# Altium schematic sheet psu.SchDoc
size A
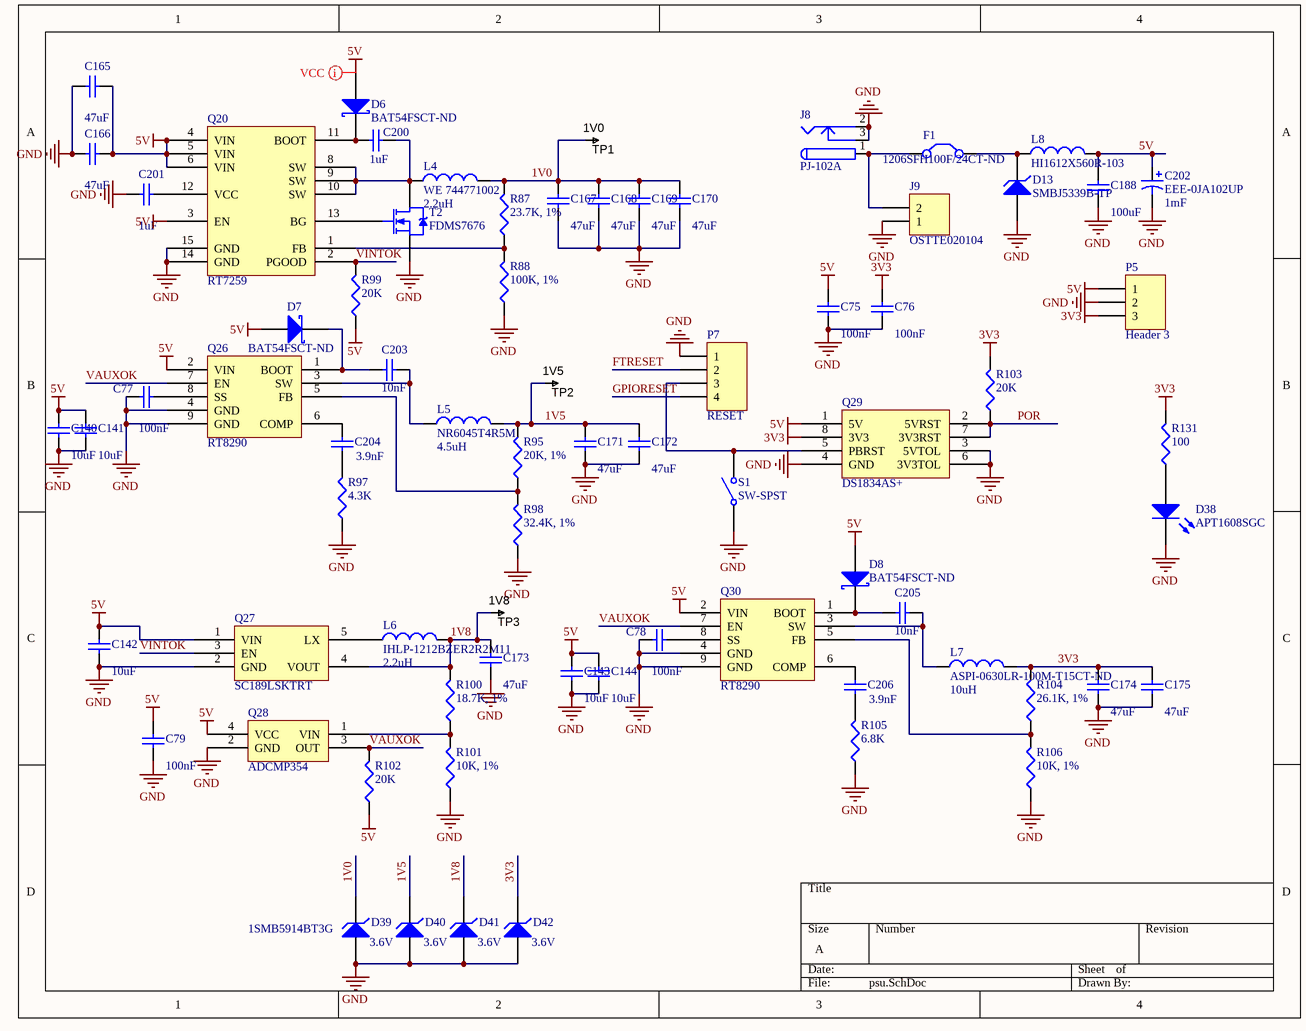
[diagram p0: psu.SchDoc]

## Parts
C75  value 100nF  [CAPC1005X06L]  (hidden comment: Cap)
C76  value 100nF  [CAPC1005X06L]  (hidden comment: Cap)
C77  value 100nF  [CAPC1005X06L]  (hidden comment: Cap)
C78  value 100nF  [CAPC1005X06L]  (hidden comment: Cap)
C79  value 100nF  [CAPC1005X06L]  (hidden comment: Cap)
C140  value 10uF  [CAPC1608X90N]  (hidden comment: GRM188R60G106ME47)
C141  value 10uF  [CAPC1608X90N]  (hidden comment: GRM188R60G106ME47)
C142  value 10uF  [CAPC1608X90N]  (hidden comment: GRM188R60G106ME47)
C143  value 10uF  [CAPC1608X90N]  (hidden comment: GRM188R60G106ME47)
C144  value 10uF  [CAPC1608X90N]  (hidden comment: GRM188R60G106ME47)
C165  value 47uF  [CAPC3225X220N]  (hidden comment: GRM31CR60J476ME19L)
C166  value 47uF  [CAPC3225X220N]  (hidden comment: GRM31CR60J476ME19L)
C167  value 47uF  [CAPC3225X220N]  (hidden comment: GRM31CR60J476ME19L)
C168  value 47uF  [CAPC3225X220N]  (hidden comment: GRM31CR60J476ME19L)
C169  value 47uF  [CAPC3225X220N]  (hidden comment: GRM31CR60J476ME19L)
C170  value 47uF  [CAPC3225X220N]  (hidden comment: GRM31CR60J476ME19L)
C171  value 47uF  [CAPC3225X220N]  (hidden comment: GRM31CR60J476ME19L)
C172  value 47uF  [CAPC3225X220N]  (hidden comment: GRM31CR60J476ME19L)
C173  value 47uF  [CAPC3225X220N]  (hidden comment: GRM31CR60J476ME19L)
C174  value 47uF  [CAPC3225X220N]  (hidden comment: GRM31CR60J476ME19L)
C175  value 47uF  [CAPC3225X220N]  (hidden comment: GRM31CR60J476ME19L)
C188  value 100uF  [CAPC3225X220N]  (hidden comment: GRM31CR60J107ME39L)
C200  value 1uF  [CAPC1608X90N]  (hidden comment: GRM188R60J105KA01D)
C201  value 1uF  [CAPC1608X90N]  (hidden comment: GRM188R60J105KA01D)
C202  EEE-0JA102UP  value 1mF  [CAP_ELEC_SIZE_E]
C203  value 10nF  [CAPC1005X06L]  (hidden comment: GRM188R71H103KA01D)
C204  value 3.9nF  [CAPC1608X90N]  (hidden comment: CL10B393KO8NNNC)
C205  value 10nF  [CAPC1005X06L]  (hidden comment: GRM188R71H103KA01D)
C206  value 3.9nF  [CAPC1608X90N]  (hidden comment: CL10B393KO8NNNC)
D6  BAT54FSCT-ND  [BAT54]
D7  BAT54FSCT-ND  [BAT54]
D8  BAT54FSCT-ND  [BAT54]
D13  SMBJ5339B-TP  [DO-214AA]
D38  APT1608SGC  [LED-0603]
D39  1SMB5914BT3G  value 3.6V  [DO-214AA]
D40  value 3.6V  [DO-214AA]  (hidden comment: 1SMB5914BT3G)
D41  value 3.6V  [DO-214AA]  (hidden comment: 1SMB5914BT3G)
D42  value 3.6V  [DO-214AA]  (hidden comment: 1SMB5914BT3G)
F1  1206SFH100F/24CT-ND  [CAPC3225X220N]
J8  PJ-102A  [PJ-102A]
J9  OSTTE020104  [OSTTEE02014]
L4  WE 744771002  value 2.2uH  [WE 744771002]
L5  NR6045T4R5M  value 4.5uH  [NR6045]
L6  IHLP-1212BZER2R2M11  value 2.2uH  [IHLP-1212BZ]
L7  ASPI-0630LR-100M-T15CT-ND  value 10uH  [ASPI-0630LR]
L8  HI1612X560R-103  [IND1612]
P5  Header 3  [HDR1X3]
P7  RESET  [HDR1X4]
Q20  RT7259  [WFDN-14L 4x3]
Q26  RT8290  [SOIC127P600X135_HS-9N]
Q27  SC189LSKTRT  [SOT23-5]
Q28  ADCMP354  [SC70-4]
Q29  DS1834AS+  [SOIC127P600X175-8AN]
Q30  RT8290  [SOIC127P600X135_HS-9N]
R87  value 23.7K, 1%  [J1-0603]  (hidden comment: RC1608F2372CS)
R88  value 100K, 1%  [J1-0603]  (hidden comment: RC1608F104CS)
R95  value 20K, 1%  [J1-0603]  (hidden comment: RC1608F203CS)
R97  value 4.3K  [J1-0603]  (hidden comment: RC1608F432CS)
R98  value 32.4K, 1%  [J1-0603]  (hidden comment: RC1608F3242CS)
R99  value 20K  [J1-0603]  (hidden comment: RC1608F203CS)
R100  value 18.7K, 1%  [J1-0603]  (hidden comment: RC1608F1872CS)
R101  value 10K, 1%  [J1-0603]  (hidden comment: RC1608F103CS)
R102  value 20K  [J1-0603]  (hidden comment: RC1608F203CS)
R103  value 20K  [J1-0603]  (hidden comment: RC1608F203CS)
R104  value 26.1K, 1%  [J1-0603]  (hidden comment: RC1608F2612CS)
R105  value 6.8K  [J1-0603]  (hidden comment: RC1608F682CS)
R106  value 10K, 1%  [J1-0603]  (hidden comment: RC1608F103CS)
R131  value 100  [J1-0603]  (hidden comment: RC1608F101CS)
S1  SW-SPST  [FSM4JSMA]
T2  FDMS7676  [PowerSO8]
TP1  1V0  [TP-R60]  (no BOM)
TP2  1V5  [TP-R60]  (no BOM)
TP3  1V8  [TP-R60]  (no BOM)

## Nets
3V3: C76.2 C174.2 C175.2 D42.K L7.2 P5.3 Q29.8(3V3) R103.2 R104.2 R131.2
5V: C75.2 C79.2 C140.2 C141.2 C142.2 C143.2 C144.2 C165.2 C166.2 C188.2 C202.1 D6.1(A) D7.1(A) D8.1(A) L8.2 P5.1 Q20.3(EN) Q20.4(VIN) Q20.5(VIN) Q20.6(VIN) Q26.2(VIN) Q27.1(VIN) Q28.4(VCC) Q29.1(5V) Q30.2(VIN) R99.1 R102.1
GND: C75.1 C76.1 C77.1 C78.1 C79.1 C140.1 C141.1 C142.1 C143.1 C144.1 C165.1 C166.1 C167.1 C168.1 C169.1 C170.1 C171.1 C172.1 C173.1 C174.1 C175.1 C188.1 C201.2 C202.2 D13.A D38.K D39.A D40.A D41.A D42.A J8.2 J8.3 J9.1 P5.2 P7.1 Q20.14(GND) Q20.15(GND) Q26.4(GND) Q26.9(GND) Q27.2(GND) Q28.2(GND) Q29.3(5VTOL) Q29.4(GND) Q29.6(3V3TOL) Q30.4(GND) Q30.9(GND) R88.1 R97.1 R98.1 R101.1 R105.1 R106.1 S1.4(COMMON) T2.3(S)
1V0: C167.2 C168.2 C169.2 C170.2 D39.K L4.2 R87.2 TP1.1
1V5: C171.2 C172.2 D40.K L5.2 R95.2 TP2.1
1V8: C173.2 D41.K L6.2 Q27.4(VOUT) R100.2 TP3.1
FTRESET: P7.2
GPIORESET: P7.4
POR: Q29.2(5VRST) Q29.7(3V3RST) R103.1
VAUXOK: Q26.7(EN) Q28.3(OUT) Q30.7(EN) R102.2
VINTOK: Q20.2(PGOOD) Q27.3(EN) R99.2
NetC77_2: C77.2 Q26.8(SS)
NetC78_2: C78.2 Q30.8(SS)
NetC200_1: C200.1 L4.1 Q20.8(SW) Q20.9(SW) Q20.10(SW) T2.2(D)
NetC200_2: C200.2 D6.2(K) Q20.11(BOOT)
NetC201_1: C201.1 Q20.12(VCC)
NetC203_1: C203.1 L5.1 Q26.3(SW)
NetC203_2: C203.2 D7.2(K) Q26.1(BOOT)
NetC204_1: C204.1 R97.2
NetC204_2: C204.2 Q26.6(COMP)
NetC205_1: C205.1 L7.1 Q30.3(SW)
NetC205_2: C205.2 D8.2(K) Q30.1(BOOT)
NetC206_1: C206.1 R105.2
NetC206_2: C206.2 Q30.6(COMP)
NetD13_K: D13.K F1.2(C2) L8.1
NetD38_A: D38.A R131.1
NetF1_1: F1.1(C1) J8.1 J9.2
NetL6_1: L6.1 Q27.5(LX)
NetP7_3: P7.3 Q29.5(PBRST) S1.2(NO)
NetQ20_1: Q20.1(FB) R87.1 R88.2
NetQ20_13: Q20.13(BG) T2.1(G)
NetQ26_5: Q26.5(FB) R95.1 R98.2
NetQ28_1: Q28.1(VIN) R100.1 R101.2
NetQ30_5: Q30.5(FB) R104.1 R106.2

## Layout directives
net class VCC: 5V

## Library data of the parts
C75-C79 C140-C144 C165-C175 C188 C200 C201 C203-C206 = Cap: Capacitor; Published: 8-Jun-2000; LatestRevisionDate: 17-Jul-2002; LatestRevisionNote: Re-released for DXP Platform.; PackageReference: RAD-0.3; Publisher: Altium Limited; PackageDescription: Radial Cap, Thru-Hole; 2 Leads; 0.3 in Pin Spacing; Supplier 1: Digi-Key
  C75-C79: Supplier Part Number 1: 1276-1443-1-ND
  C140-C144: Supplier Part Number 1: 490-3298-1-ND
  C165-C175: Supplier Part Number 1: 490-3907-1-ND
  C188: Supplier Part Number 1: 490-4539-1-ND
  C200 C201: Supplier Part Number 1: 490-1550-1-ND
  C203 C205: Supplier Part Number 1: 490-4516-1-ND
  C204 C206: Supplier Part Number 1: 1276-2057-1-ND
C202 = Cap Pol1: Polarized Capacitor (Radial); Published: 8-Jun-2000; LatestRevisionDate: 17-Jul-2002; LatestRevisionNote: Re-released for DXP Platform.; PackageReference: RB7.6-15; Publisher: Altium Limited; PackageDescription: Polarized Capacitor (Radial); 2 Leads; Supplier 1: Digi-Key; Supplier Part Number 1: PCE3855CT-ND
D6-D8 = D Schottky: Schottky Diode; Published: 8-Jun-2000; LatestRevisionDate: 17-Jul-2002; LatestRevisionNote: Re-released for DXP Platform.; PackageReference: SMB; Publisher: Altium Limited; PackageDescription: DO-214-AA/SMB; 2 C-Bend Leads; Body 5.3 x 3.6 mm, inc. leads (LxW); Code_JEDEC: DO-214-AA; Supplier 1: Digi-Key; Supplier Part Number 1: BAT54FSCT-ND
D13 D39-D42 = D Zener: Zener Diode; Published: 8-Jun-2000; LatestRevisionDate: 17-Jul-2002; LatestRevisionNote: Re-released for DXP Platform.; PackageReference: DIODE-0.7; Publisher: Altium Limited; PackageDescription: Diode, Thru-Hole; 2 Leads; 0.7 in Pin Spacing; Supplier 1: Digi-Key
  D13: Supplier Part Number 1: SMBJ5339B-TPMSCT-ND
  D39-D42: Supplier Part Number 1: 1SMB5914BT3GOSCT-ND
D38 = LED2: Typical RED, GREEN, YELLOW, AMBER GaAs LED; Published: 8-Jun-2000; LatestRevisionDate: 17-Jul-2002; LatestRevisionNote: Re-released for DXP Platform.; PackageVersion: Feb-2002; PackageReference: 3.2X1.6X1.1; Publisher: Altium Limited; PackageDescription: SM LED; 2 Flat Leads; Supplier 1: Digi-Key; Supplier Part Number 1: 754-1121-1-ND
F1 = Jumper: 10A Fuse; Published: 24-Mar-1999; LatestRevisionDate: 17-Jul-2002; LatestRevisionNote: Re-released for DXP Platform.; PackageReference: RAD-0.2; Publisher: Altium Limited; PackageDescription: Radial Cap, Thru-Hole; 2 Leads; 0.2 in Pin Spacing; Supplier 1: Digi-Key; Supplier Part Number 1: 1206SFH100F/24CT-ND
J8 = PWR2.5: Low Voltage Power Supply Connector; Published: 17-Dec-2003; DatasheetDocument: 09-May-2002; Publisher: Altium Limited; ComponentLink1Description: Manufacturer Link; ComponentLink1URL: http://domino.kycon.com/internet/Products.html; Supplier 1: Digi-Key; Supplier Part Number 1: CP-102A-ND
J9 = Header 2: Header, 2-Pin; LatestRevisionDate: 17-Jul-2002; LatestRevisionNote: Re-released for DXP Platform.; Publisher: Altium Limited; Supplier 1: Digi-Key; Supplier Part Number 1: ED2740-ND
L4-L7 = Inductor: Code_IEC: 1005; Published: 8-Jun-2000; LatestRevisionDate: 29-May-2009; LatestRevisionNote: IPC-7351 Footprint Added.; PackageReference: 0402-A; Publisher: Altium Limited; PackageDescription: Chip Inductor; Code_JEITA: 0402; Supplier 1: Digi-Key
  L4: Supplier Part Number 1: 732-1204-1-ND
  L5: Supplier Part Number 1: 587-2079-1-ND
  L6: Supplier Part Number 1: 541-1322-1-ND
  L7: Supplier Part Number 1: ASPI-0630LR-100M-T15CT-ND
L8 = Inductor: Code_IEC: 1005; Value: 10mH; Published: 8-Jun-2000; LatestRevisionDate: 29-May-2009; LatestRevisionNote: IPC-7351 Footprint Added.; PackageReference: 0402-A; Publisher: Altium Limited; PackageDescription: Chip Inductor; Code_JEITA: 0402; Supplier 1: Digi-Key; Supplier Part Number 1: 240-2499-1-ND
P5 = Header 3: Header, 3-Pin; LatestRevisionDate: 17-Jul-2002; LatestRevisionNote: Re-released for DXP Platform.; Publisher: Altium Limited
P7 = Header 4: Header, 4-Pin; LatestRevisionDate: 17-Jul-2002; LatestRevisionNote: Re-released for DXP Platform.; Publisher: Altium Limited
Q27 = SC189: Supplier 1: Digi-Key; Supplier Part Number 1: SC189LSKCT-ND
Q29 = DS1834: Supplier 1: Digi-Key; Supplier Part Number 1: DS1834AS+-ND
R87 R88 R95 R97-R106 R131 = Res3: Resistor; Published: 8-Jun-2000; LatestRevisionDate: 29-May-2009; LatestRevisionNote: IPC-7351 Footprint Added.; PackageReference: J1-0603; PackageDescription: Chip Resistor; Supplier 1: Digi-Key
  R87: Publisher: Altium Limited; Supplier Part Number 1: 1276-4776-1-ND
  R88: Publisher: Altium Limited; Supplier Part Number 1: 1276-3486-1-ND
  R95 R99 R102 R103: Publisher: Altium Limited; Supplier Part Number 1: 1276-4768-1-ND
  R97: Publisher: Altium Limited; Supplier Part Number 1: 1276-4706-1-ND
  R98: Publisher: Altium Limited; Supplier Part Number 1: 1276-3500-1-ND
  R100: Publisher: Altium Limited; Supplier Part Number 1: 1276-3494-1-ND
  R101 R106: Publisher: Altium Limited; Supplier Part Number 1: 1276-3485-1-ND
  R104: Publisher: Altium Limited; Supplier Part Number 1: 1276-4779-1-ND
  R105: Publisher: Altium Limited; Supplier Part Number 1: 1276-4728-1-ND
  R131: Supplier Part Number 1: 1276-3482-1-ND
S1 = SW-SPST: Single-Pole, Single-Throw Switch; Published: 24-Mar-1999; LatestRevisionDate: 17-Jul-2002; LatestRevisionNote: Re-released for DXP Platform.; PackageReference: SPST-2; Publisher: Altium Limited; PackageDescription: Switch; 2 Leads; Supplier 1: Digi-Key; Supplier Part Number 1: 450-1129-ND
T2 = NMOS-2: N-Channel Power MOSFET; Note: Pin 2 is electrically connected to pin 4.; Published: 8-Jun-2000; LatestRevisionDate: 17-Jul-2002; LatestRevisionNote: Re-released for DXP Platform.; DatasheetVersion: PD-9.814; PackageVersion: Feb-1997; PackageReference: TO-220AB; Publisher: Altium Limited; PackageDescription: TO, Thru-Hole, Vertical, Heatsink Mounted; 3 In-Line Leads; Pitch 2.54 mm; ComponentLink1Description: Manufacturer Link; ComponentLink1URL: http://www.irf.com/; Supplier 1: Digi-Key; Supplier Part Number 1: FDMS7676CT-ND
TP1-TP3 = TESTPOINT: SMD test pin
Q20 = RT7259: Supplier 1: Digi-Key; Supplier Part Number 1: 1028-1199-1-ND
Q26 Q30 = RT8290: Supplier 1: Digi-Key; Supplier Part Number 1: 1028-1047-1-ND
Q28 = ADCMP354: Supplier 1: Digi-Key; Supplier Part Number 1: ADCMP354YKSZ-REEL7CT-ND